# EAGLE schematic MegaShieldTrioV2 (EAGLE 7.2.0)
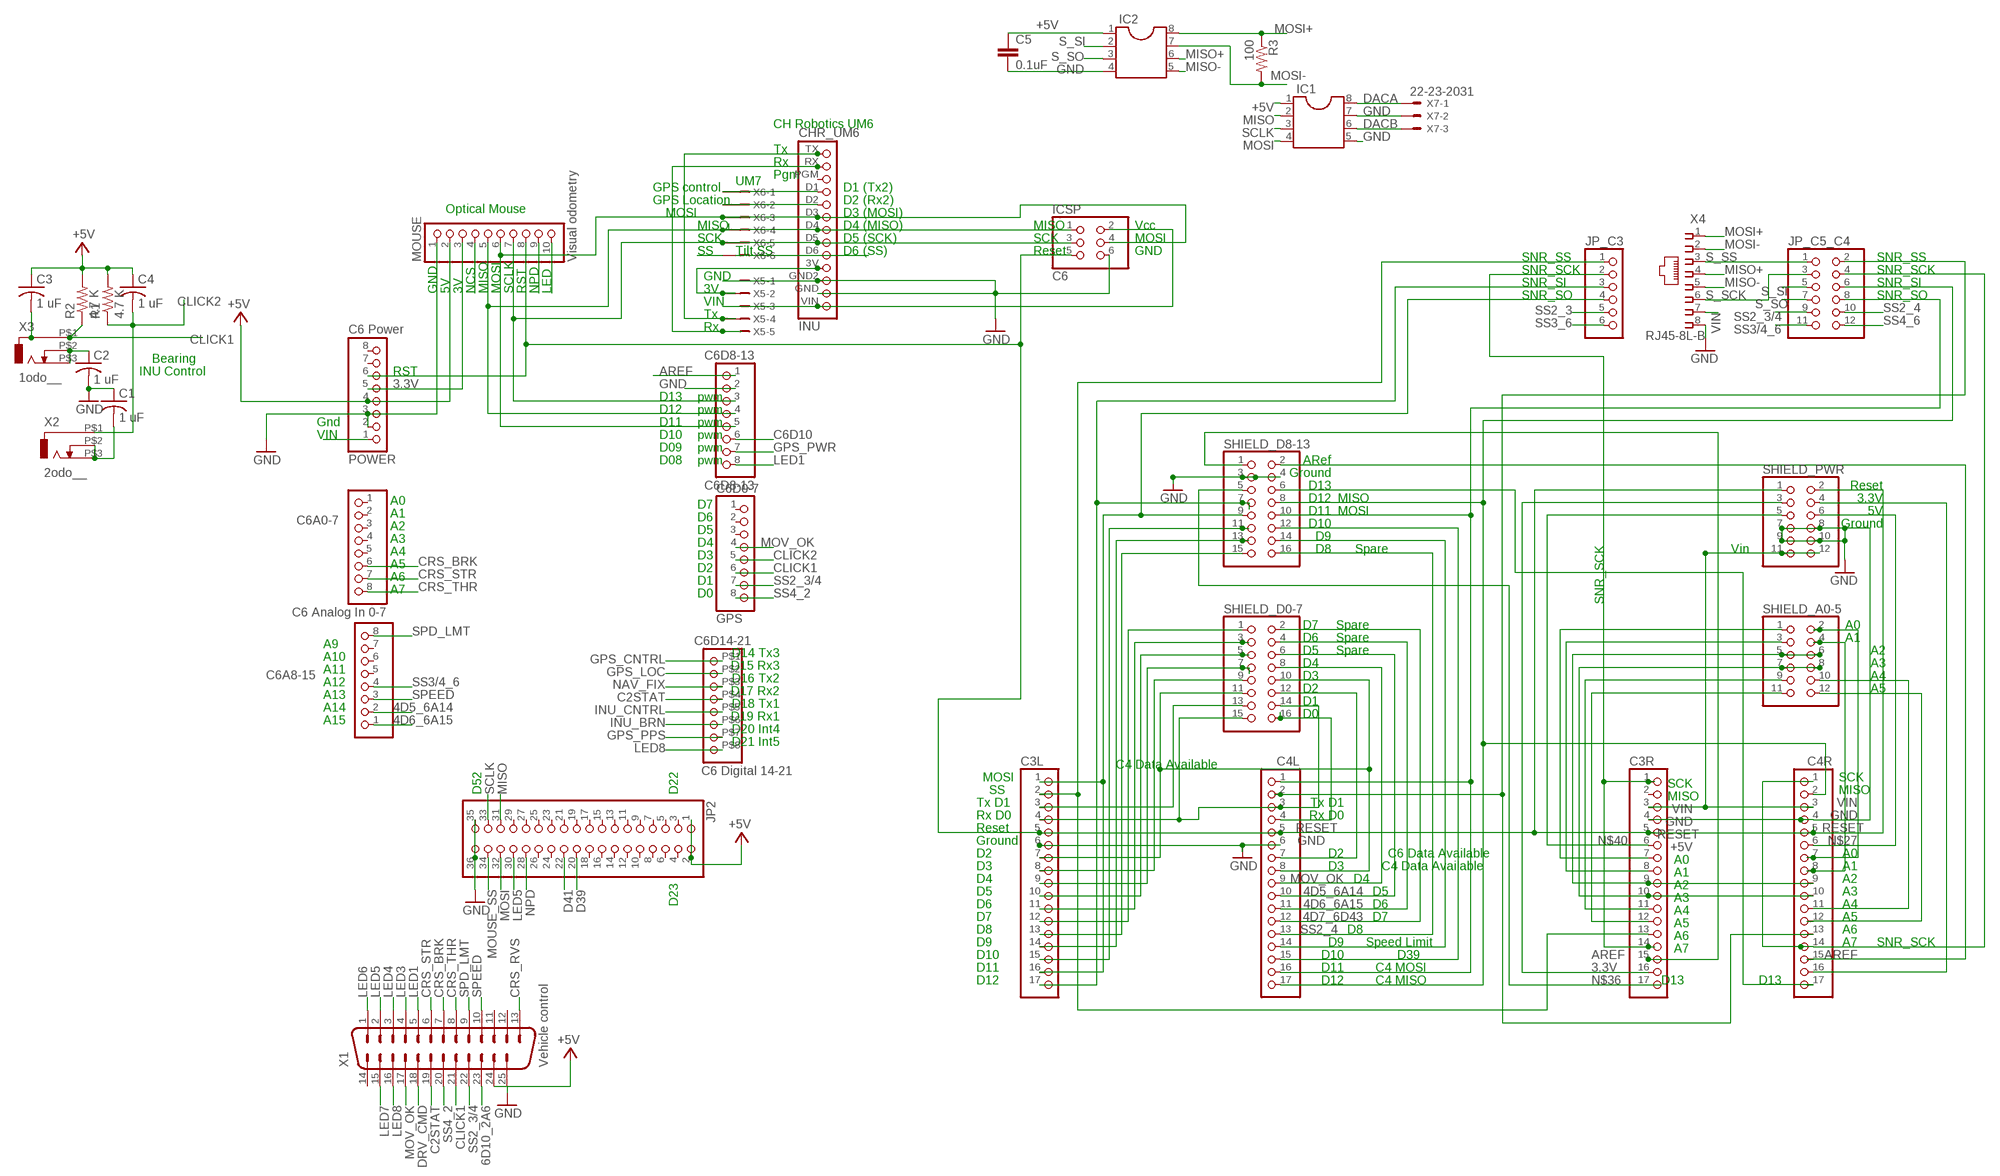
[diagram p0: schematic, sheet 1]

## Parts
C1  1 uF  C-US025-030X050  [C025-030X050]
C2  1 uF  C-US025-030X050  [C025-030X050]
C3  1 uF  C-US025-030X050  [C025-030X050]
C3L  PINHD-1X17  [1X17]
C3R  PINHD-1X17  [1X17]
C4  1 uF  C-US025-030X050  [C025-030X050]
C4L  PINHD-1X17  [1X17]
C4R  PINHD-1X17  [1X17]
C5  0.1uF  C2.5/2  [C2.5-2]
C6A0-7  C6 Analog In 0-7  PINHD-1X8  [1X08]
C6A8-15  PINHD-1X8  [1X08]
C6D0-7  GPS  PINHD-1X8  [1X08]
C6D8-13  C6D8-13  PINHD-1X8  [1X08]
C6D14-21  C6 Digital 14-21  PINHD-1X8SMALL8  [1X8HEADER]
IC1  DIL8  [DIL08]
IC2  DIL8  [DIL08]
ICSP  C6  PINHD-2X3  [2X03]
INU  CHR_UM6  [CHR_UM6]
JP2  PINHD-2X18  [2X18]
JP_C3  PINHD-1X6  [1X06]
JP_C5_C4  PINHD-2X6  [2X06]
MOUSE  Visual odometry  PINHD-1X10  [1X10]
POWER  C6 Power  PINHD-1X8  [1X08]
R1  4.7 K  R-US_0207/10  [0207/10]
R2  4.7 K  R-US_0207/10  [0207/10]
R3  100  R-US_0204/5  [0204/5]
SHIELD_A0-5  PINHD-2X6  [2X06]
SHIELD_D0-7  PINHD-2X8  [2X08]
SHIELD_D8-13  PINHD-2X8  [2X08]
SHIELD_PWR  PINHD-2X6  [2X06]
X1  Vehicle control  M25H  [M25H]
X2  2odo__  ODO_JACK  [ODO_JACK]
X3  1odo__  ODO_JACK  [ODO_JACK]
X4  RJ45-8L-B  [RJ45-NO-SHIELD]
X5  S5B-ZR  S4B-ZR  [S5B-ZR]
X6  S6B-ZR  S4B-ZR  [S6B-ZR]
X7  22-23-2031  [22-23-2031]

## Nets
3.3V: C3R.16 MOUSE.3 POWER.5 SHIELD_PWR.3
4D5_6A14: C4L.10 C6A8-15.2 SHIELD_D0-7.6
4D6_6A15: C4L.11 C6A8-15.1 SHIELD_D0-7.4
4D7_6D43: C4L.12 SHIELD_D0-7.2
6D10_2A6: X1.23
+5V: C3.1 C4.1 C5.1 IC1.1 IC2.1 JP2.1 JP2.2 MOUSE.2 POWER.4 R1.2 R2.2 X1.24
AREF: C3R.15 C4R.15 C6D8-13.1 SHIELD_D8-13.1 SHIELD_D8-13.2
C2STAT: C6D14-21.P$4 X1.19
C4AVL: C3L.7 C4L.8 SHIELD_D0-7.10 SHIELD_D0-7.11
C4D12: C4L.17 C4R.2 SHIELD_D8-13.8
C6AVL: C4L.7 SHIELD_D0-7.12
C6D10: C6D8-13.6
CLICK1: C3.2 C6D0-7.6 R2.1 X1.21 X3.P$1
CLICK2: C4.2 C6D0-7.5 R1.1 X2.P$1
CRS_BRK: C3L.10 C6A0-7.6 SHIELD_D0-7.5 X1.7
CRS_RVS: X1.13
CRS_STR: C6A0-7.7 X1.6
CRS_THR: C6A0-7.8 X1.8
D39: JP2.20
D41: JP2.22
DACA: IC1.8 X7.1
DACB: IC1.6 X7.3
DRV_CMD: X1.18
F2RNG: C4R.12 SHIELD_A0-5.12
FL_RNG: C4R.8 SHIELD_A0-5.4
GND: C1.1 C2.2 C3L.6 C3R.4 C4L.6 C4R.4 C5.2 C6D8-13.2 IC1.5 IC1.7 IC2.4 ICSP.6 INU.GND INU.GND2 JP2.35 JP2.36 MOUSE.1 POWER.2 POWER.3 SHIELD_D8-13.3 SHIELD_D8-13.4 SHIELD_PWR.7 SHIELD_PWR.8 SHIELD_PWR.9 SHIELD_PWR.10 X1.25 X4.8 X5.1 X7.2
GPS_CNTRL: C6D14-21.P$1 INU.D1 X6.1
GPS_LOC: C6D14-21.P$2
GPS_PPS: C6D14-21.P$7
GPS_PWR: C6D8-13.7
INU_BRN: C6D14-21.P$6
INU_CNTRL: C6D14-21.P$5
INU_SS: INU.D6
L_RNG: C3R.10 C4R.10 SHIELD_A0-5.7 SHIELD_A0-5.8
LED1: C6D8-13.8 X1.5
LED3: X1.4
LED4: X1.3
LED5: JP2.30 MOUSE.10 X1.2
LED6: X1.1
LED7: X1.15
LED8: C6D14-21.P$8 X1.16
MISO: C6D8-13.4 IC1.2 ICSP.1 INU.D4 JP2.31 MOUSE.5 X6.4
MISO+: IC2.6 X4.4
MISO-: IC2.5 X4.5
MOSI: C6D8-13.5 IC1.4 ICSP.4 INU.D3 JP2.32 MOUSE.6 X6.3
MOSI+: IC2.8 R3.1 X4.1
MOSI-: IC2.7 R3.2 X4.2
MOUSE_SS: JP2.34 MOUSE.4
MOV_OK: C4L.9 C6D0-7.4 SHIELD_D0-7.8 X1.17
N$1: INU.3V X5.2
N$2: INU.D2 X6.2
N$3: INU.TX X5.4
N$4: C3R.7 SHIELD_A0-5.1
N$5: C4R.7 SHIELD_A0-5.2
N$6: X6.6
N$8: C4R.16 SHIELD_PWR.4
N$11: C2.1 X3.P$2 X3.P$3
N$17: INU.RX X5.5
N$23: C1.2 X2.P$2 X2.P$3
N$24: POWER.1
N$27: C4R.6 SHIELD_PWR.6
N$36: C3R.17 SHIELD_D8-13.5
N$38: C3L.3 SHIELD_D0-7.13
N$39: ICSP.2 INU.VIN X5.3
N$40: C3R.6 SHIELD_PWR.5
N$41: C3L.8 SHIELD_D0-7.9
N$42: C3R.8 SHIELD_A0-5.3
N$45: C3R.11 SHIELD_A0-5.9
N$46: C3R.12 SHIELD_A0-5.11
N$47: C3R.1 C3R.14 JP_C3.2
N$48: C4R.1 C4R.14
N$49: C4R.11 SHIELD_A0-5.10
N$51: C4R.17 SHIELD_D8-13.6
N$53: C3L.9 SHIELD_D0-7.7
N$54: C3L.11 SHIELD_D0-7.3
N$55: C3L.12 SHIELD_D0-7.1
N$57: C3L.14 SHIELD_D8-13.13
N$59: C3L.17 JP_C3.3 SHIELD_D8-13.7
N$60: C3L.2 C3R.13 JP_C3.1
NAV_FIX: C4L.4 C6D14-21.P$3 SHIELD_D0-7.16
NPD: JP2.28 MOUSE.9
PATH: C4L.3 SHIELD_D0-7.14 SHIELD_D0-7.15
RESET: C3L.5 C3R.5 C4L.5 C4R.5 ICSP.5 MOUSE.8 POWER.6 SHIELD_PWR.1 SHIELD_PWR.2
S_SCK: JP_C5_C4.3 X4.6
S_SI: IC2.2 JP_C5_C4.5
S_SO: IC2.3 JP_C5_C4.7
S_SS: JP_C5_C4.1 X4.3
SCK: ICSP.3 INU.D5 MOUSE.7 X6.5
SCLK: IC1.3 JP2.33
SNR_SEL: C4L.2 C4R.13 JP_C5_C4.2
SNR_SO: C4L.1 C4L.16 SHIELD_D8-13.10
SPD_LMT: C4L.14 C6A8-15.8 SHIELD_D8-13.14 X1.9
SPEED: C3L.1 C3L.16 C6A8-15.3 SHIELD_D8-13.9 X1.10
SS2_3: C3L.13 JP_C3.5 SHIELD_D8-13.15
SS2_3/4: C6D0-7.7 JP_C5_C4.9 X1.22
SS2_4: C4L.13 JP_C5_C4.10 SHIELD_D8-13.16
SS3/4_6: C6A8-15.4 JP_C5_C4.11
SS3_6: C3L.15 JP_C3.6 SHIELD_D8-13.11
SS4_2: C6D0-7.8 X1.20
SS4_6: C4L.15 JP_C5_C4.12 SHIELD_D8-13.12
VIN: C3R.3 C3R.9 C4R.3 C4R.9 SHIELD_A0-5.5 SHIELD_A0-5.6 SHIELD_PWR.11 SHIELD_PWR.12 X4.7
Unconnected: C3L.4 C3R.2 C6A0-7.1 C6A0-7.2 C6A0-7.3 C6A0-7.4 C6A0-7.5 C6A8-15.5 C6A8-15.6 C6A8-15.7 C6D0-7.1 C6D0-7.2 C6D0-7.3 C6D8-13.3 INU.PGM JP2.3 JP2.4 JP2.5 JP2.6 JP2.7 JP2.8 JP2.9 JP2.10 JP2.11 JP2.12 JP2.13 JP2.14 JP2.15 JP2.16 JP2.17 JP2.18 JP2.19 JP2.21 JP2.23 JP2.24 JP2.25 JP2.26 JP2.27 JP2.29 JP_C3.4 JP_C5_C4.4 JP_C5_C4.6 JP_C5_C4.8 POWER.7 POWER.8 X1.11 X1.12 X1.14

## Notes on the sheet
- CH Robotics UM6
- Tx
- Rx
- Pgm
- UM7
- GPS control | D1 (Tx2)
- Optical Mouse | GPS Location | D2 (Rx2)
- MOSI | D3 (MOSI)
- MISO | D4 (MISO) | MISO | Vcc
- SCK | D5 (SCK) | SCK | MOSI
- SS | Tilt SS | D6 (SS) | Reset | GND
- SNR_SS | SNR_SS
- SNR_SCK | SNR_SCK
- GND
- SNR_SI | SNR_SI
- GND | 5V | 3V | NCS | MISO | MOSI | SCLK | RST | NPD | LED | 3V
- SNR_SO | SNR_SO
- VIN
- Tx
- Rx
- Bearing
- INU Control | RST
- D13 | pwm
- D12 | pwm
- Gnd | D11 | pwm
- VIN | D10 | pwm
- D09 | pwm
- D08 | pwm | ARef
- Ground
- D13 | Reset
- A0
- D12 | MISO | 3.3V
- A1 | D7
- D11 | MOSI | 5V
- A2 | D6
- D10 | Ground
- A3 | D5
- D9
- A4 | D4
- D8 | Spare | Vin
- A5 | D3
- A6 | D2
- A7 | D1
- D0
- SNR_SCK
- D7 | Spare | A0
- D6 | Spare | A1
- A9 | D14 Tx3
- D5 | Spare | A2
- A10 | D15 Rx3
- D4 | A3
- A11 | D16 Tx2
- D3 | A4
- A12 | D17 Rx2
- D2 | A5
- A13 | D18 Tx1
- D1
- A14 | D19 Rx1
- D0
- A15 | D20 Int4
- D21 Int5
- C4 Data Available
- MOSI | SCK
- SCK
- D52 | D22 | SS | MISO
- MISO
- Tx D1 | Tx D1
- Rx D0 | Rx D0
- Reset
- Ground
- D2 | D2 | C6 Data Available | A0
- A0
- D3 | D3 | C4 Data Available | A1
- A1
- D23 | D4 | D4 | A2
- A2
- D5 | D5 | A3
- A3
- D6 | D6 | A4
- A4
- D7 | D7 | A5
- A5
- D8 | D8 | A6
- A6
- D9 | D9 | Speed Limit | A7 | SNR_SCK
- A7
- D10 | D10 | D39
- D11 | D11 | C4 MOSI
- D12 | D12 | C4 MISO | D13 | D13

## Library data of the parts
C1-C4 = rcl:C-US: CAPACITOR, American symbol
C3L C3R C4L C4R = pinhead:PINHD-1X17: PIN HEADER
C5 = capacitor-wima:C: CAPACITOR naming: grid - package width
C6A0-7 C6A8-15 C6D0-7 C6D8-13 POWER = pinhead:PINHD-1X8: PIN HEADER
C6D14-21 = Elcano:PINHD-1X8: PIN HEADER
IC1 IC2 = ic-package:DIL8: Dual In Line / Socket
ICSP = pinhead:PINHD-2X3: PIN HEADER
INU = Elcano:CHR_UM6: Tilt sensor
JP2 = pinhead:PINHD-2X18: PIN HEADER
JP_C3 = pinhead:PINHD-1X6: PIN HEADER
JP_C5_C4 SHIELD_A0-5 SHIELD_PWR = pinhead:PINHD-2X6: PIN HEADER
MOUSE = pinhead:PINHD-1X10: PIN HEADER
R1 R2 = rcl:R-US_: RESISTOR, American symbol
R3 = resistor:R-US_: RESISTOR, American symbol
SHIELD_D0-7 SHIELD_D8-13 = pinhead:PINHD-2X8: PIN HEADER
X1 = con-subd:M25: SUB-D; OC_FARNELL: unknown; OC_NEWARK: unknown
X2 X3 = Elcano:ODO_JACK
X4 = con-tycoelectronics:RJ45: CORCOM Modular RJ Jacks No Shield Source: www.tycoelectronics.com .. ENG_DS_1654001_1099_RJ_L_0507.pdf; MF: TYCO ELECTRONICS; MPN: RJ45-8L-B; OC_FARNELL: 1279843; OC_NEWARK: 52K4445
X5 = con-jst1:?4B-ZR: ZH CONNECTOR 1.5 mm, 4 pin 1 row Source: http://www.jst.com .. eZH.pdf; MF: FARNELL; MPN: S4B-ZR(LF)(SN); OC_FARNELL: 9491830; OC_NEWARK: 38K8076
X6 = con-jst:?4B-ZR: ZH CONNECTOR 1.5 mm, 6 pin 1 row Source: http://www.jst.com .. eZH.pdf; MF: FARNELL; MPN: S4B-ZR(LF)(SN); OC_FARNELL: 9491830; OC_NEWARK: 38K8076
X7 = con-molex:22-23-2031: .100" (2.54mm) Center Header - 3 Pin; MF: MOLEX; MPN: 22-23-2031; OC_FARNELL: 1462950; OC_NEWARK: 30C0862

## Net classes
0 default: width 0.152 mm, drill 0.305 mm, clearance 0.152 mm